# Altium schematic sheet POWER.SchDoc
size A4
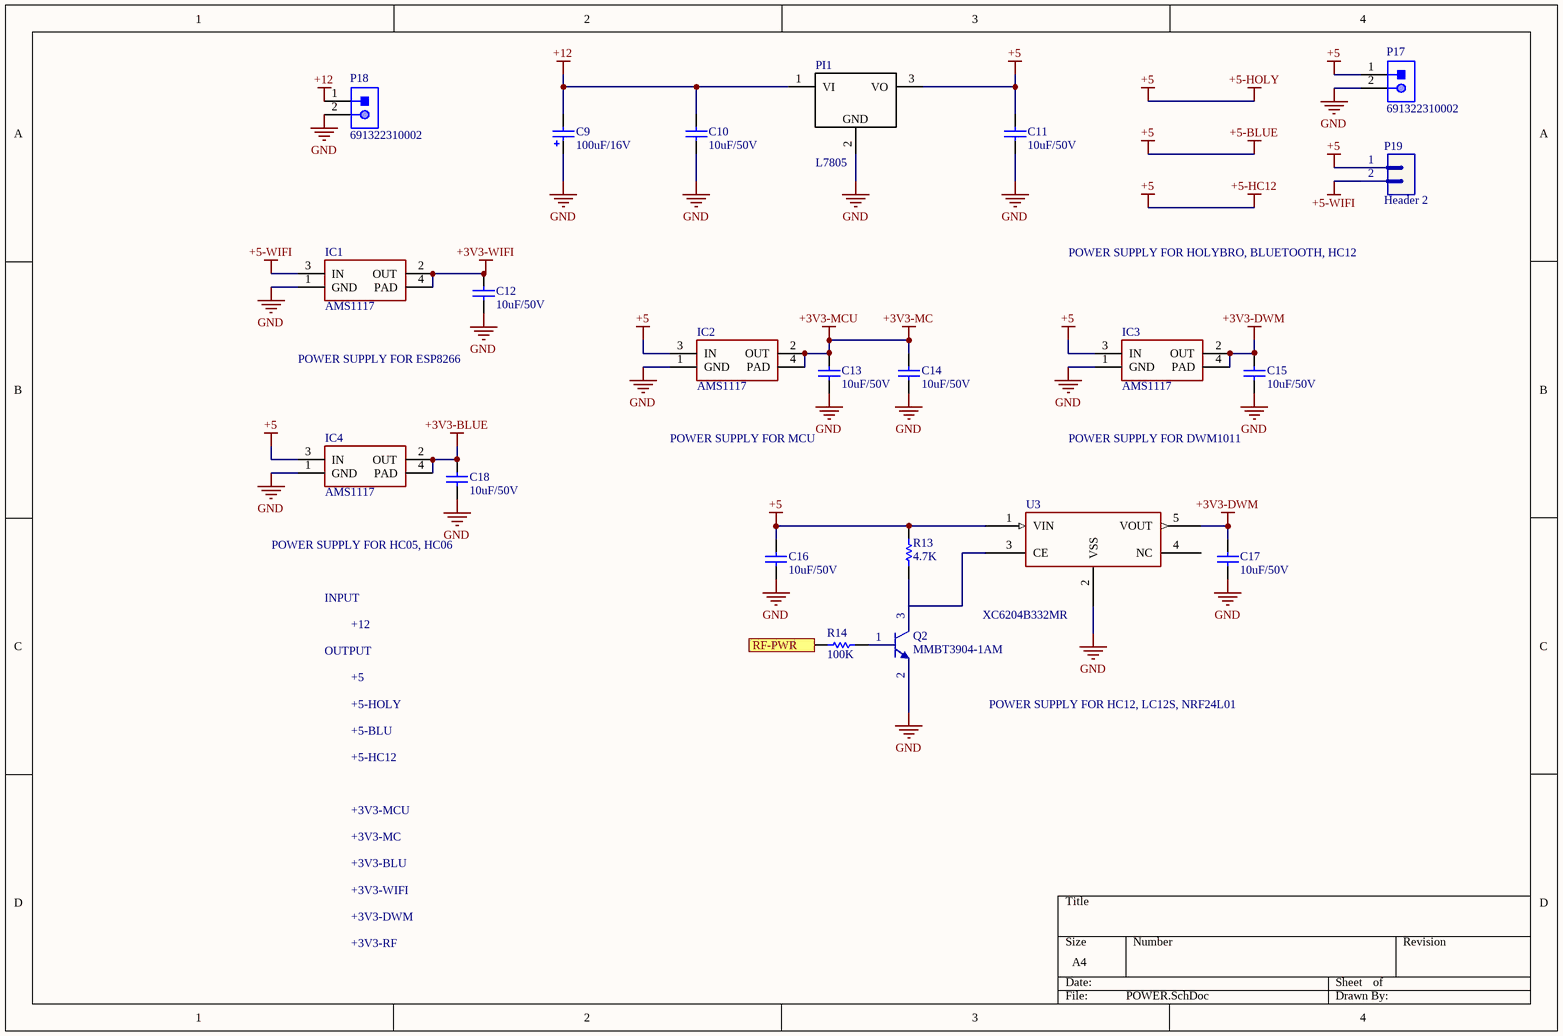
[diagram p0: POWER.SchDoc]

## Parts
C9  value 100uF/16V  [CAP-SM-AL-SIZE-D-D6L6]  (hidden comment: Cap-Al-100uF-16V-D6L5)
C10  value 10uF/50V  [CAP-SM-0805]  (hidden comment: Cap-10uF-50V-0805)
C11  value 10uF/50V  [CAP-SM-0805]  (hidden comment: Cap-10uF-50V-0805)
C12  value 10uF/50V  [CAP-SM-0805]  (hidden comment: Cap-10uF-50V-0805)
C13  value 10uF/50V  [CAP-SM-0805]  (hidden comment: Cap-10uF-50V-0805)
C14  value 10uF/50V  [CAP-SM-0805]  (hidden comment: Cap-10uF-50V-0805)
C15  value 10uF/50V  [CAP-SM-0805]  (hidden comment: Cap-10uF-50V-0805)
C16  value 10uF/50V  [CAP-SM-0805]  (hidden comment: Cap-10uF-50V-0805)
C17  value 10uF/50V  [CAP-SM-0805]  (hidden comment: Cap-10uF-50V-0805)
C18  value 10uF/50V  [CAP-SM-0805]  (hidden comment: Cap-10uF-50V-0805)
IC1  AMS1117  [SOT223]
IC2  AMS1117  [SOT223]
IC3  AMS1117  [SOT223]
IC4  AMS1117  [SOT223]
P17  691322310002  [691322310002]
P18  691322310002  [691322310002]
P19  Header 2  [JP2]
PI1  L7805  [D2PAK]
Q2  MMBT3904-1AM  [SOT23_NEX]
R13  value 4.7K  [RES-SM-0805]  (hidden comment: Res-4.7K-0805)
R14  value 100K  [RES-SM-0805]  (hidden comment: Res-100K-0805)
U3  XC6204B332MR  [XC6204/05_SOT-00]

## Ports
RF-PWR (in)

## Nets
+3V3-BLUE: C18.2 IC4.2(OUT) IC4.4(PAD)
+3V3-DWM: C15.2 C17.2 IC3.2(OUT) IC3.4(PAD) U3.5(VOUT)
+3V3-MC: C13.2 C14.2 IC2.2(OUT) IC2.4(PAD)  [also labelled +3V3-MCU]
+3V3-WIFI: C12.2 IC1.2(OUT) IC1.4(PAD)
+5: C11.2 C16.2 IC2.3(IN) IC3.3(IN) IC4.3(IN) P17.1 P19.1 PI1.3(VO) R13.2 U3.1(VIN)  [also labelled +5-BLUE, +5-HC12, +5-HOLY]
+5-WIFI: IC1.3(IN) P19.2
+12: C9.2 C10.2 P18.1 PI1.1(VI)
GND: C9.1 C10.1 C11.1 C12.1 C13.1 C14.1 C15.1 C16.1 C17.1 C18.1 IC1.1(GND) IC2.1(GND) IC3.1(GND) IC4.1(GND) P17.2 P18.2 PI1.2 Q2.2(E) U3.2(VSS)
RF-PWR: R14.1 ; port RF-PWR
NetQ2_1: Q2.1(B) R14.2
NetQ2_3: Q2.3(C) R13.1

Not connected (* = marked no-connect by the designer): U3 3(CE) 4(NC)

## Notes on the sheet
- POWER SUPPLY FOR HOLYBRO, BLUETOOTH, HC12
- POWER SUPPLY FOR ESP8266
- POWER SUPPLY FOR MCU
- POWER SUPPLY FOR DWM1011
- POWER SUPPLY FOR HC05, HC06
- INPUT
- OUTPUT
- +12
- +5
- +5-HOLY
- POWER SUPPLY FOR HC12, LC12S, NRF24L01
- +5-BLU
- +5-HC12
- +3V3-MC
- +3V3-MCU
- +3V3-BLU
- +3V3-DWM
- +3V3-WIFI
- +3V3-RF
- (in symbol L7805-D2PAK) GND

## Library data of the parts
C9 = Cap-Al-100uF-16V-D6L5: CAP ALUM 100UF 20% 16V SMD; Manufacturer: Nichicon; Manufacturer Part Number: UWX1C101MCL1GB; Local Supplier: thegioiic; Local Supplier Link: https://thegioiic.com/products/tu-nhom-smd-100uf-16v-d6-3l5-4; Supplier 1: Digikey; Supplier 1 Part Number: 493-2105-1-ND; Supplier 1 Link: https://www.digikey.com/product-detail/en/nichicon/UWX1C101MCL1GB/493-2105-1-ND/590080
C10-C18 = Cap-10uF-50V-0805: CAP CER 10UF 50V X5R 0805; Manufacturer: Yageo; Manufacturer Part Number: CC0805KKX5R9BB106; Local Supplier: thegioiic; Local Supplier Link: https://thegioiic.com/products/tu-10uf-50v-0805; Supplier 1: Digikey; Supplier 1 Link: https://www.digikey.com/product-detail/en/yageo/CC0805KKX5R9BB106/311-3499-2-ND/7164383; Supplier 1 Part Number: 311-3499-2-ND
IC1-IC4 = AMS1117: Available in 1.8V, 2.5V, 2.85V, 3.3V, 5V, and  Adjustable Versions; Value: LM317
P17 P18 = 691322310002: WR-TBL Serie 322 Horizontal PCB Header, Pluggable, pitch 3.81mm, 2p; Compliance: RoHS; Modularity: No; Pin Number: 2; Rated Current [UL]: 10A; Working Voltage [UL]: 300VAC; ComponentLink1Description: Manufacturer; ComponentLink1URL: http://www.we-online.de; ComponentLink2URL: https://katalog.we-online.de/em/datasheet/691322310002.pdf; ComponentLink2Description: Datasheet; Mounting Technology: THT; Part Number: 691322310002; Packaging: Box; Operating Temperature: -40 to +105degC; PCB/Cable/Panel: PCB; Pitch: 3.81mm; Published Date: October 2019; Type: Horizontal; Publisher: Wurth Elektronik; Application: Pluggable
P19 = Header 2: Header, 2-Pin; LatestRevisionDate: 17-Jul-2002; LatestRevisionNote: Re-released for DXP Platform.; Publisher: Altium Limited
PI1 = L7805-D2PAK: LINEAR REGULATOR 5.0V; Supplier 1: Digi-Key; Supplier Part Number 1: 497-1170-6-ND
R13 = Res-4.7K-0805: RES SMD 4.7K OHM 5% 1/8W 0805; Manufacturer: Yageo; Manufacturer Part Number: RC0805JR-074K7L; Local Supplier: thegioiic; Local Supplier Link: https://thegioiic.com/products/dien-tro-4-7k-ohm-0805-5; Supplier 1: Digikey; Supplier 1 Link: https://www.digikey.com/product-detail/en/yageo/RC0805JR-074K7L/311-4.7KARCT-ND/731274; Supplier 1 Part Number: 311-4.7KARCT-ND
R14 = Res-100K-0805: RES 0 OHM JUMPER 0805; Manufacturer: Vishay Dale; Manufacturer Part Number: WSL080500000ZEA9; Local Supplier: thegioiic; Local Supplier Link: https://thegioiic.com/products/dien-tro-0-ohm-0805-5; Supplier 1: Digikey; Supplier 1 Link: https://www.digikey.com/product-detail/en/vishay-dale/WSL080500000ZEA9/541-3928-1-ND/7423223; Supplier 1 Part Number: 541-3928-1-ND
U3 = XC6204B332MR: Vendor: Torex Semiconductor; Built_By: EMA_UL_Team; SourceLibrary: Torex_2016-07-05_1; Manufacturer_Part_Number: XC6204B332MR; Copyright: Copyright (C) 2018 Accelerated Designs. All rights reserved; RefDes: RefDes; Type: DEV